# Altium schematic sheet ch32-mainboard-v4.SchDoc
size A2
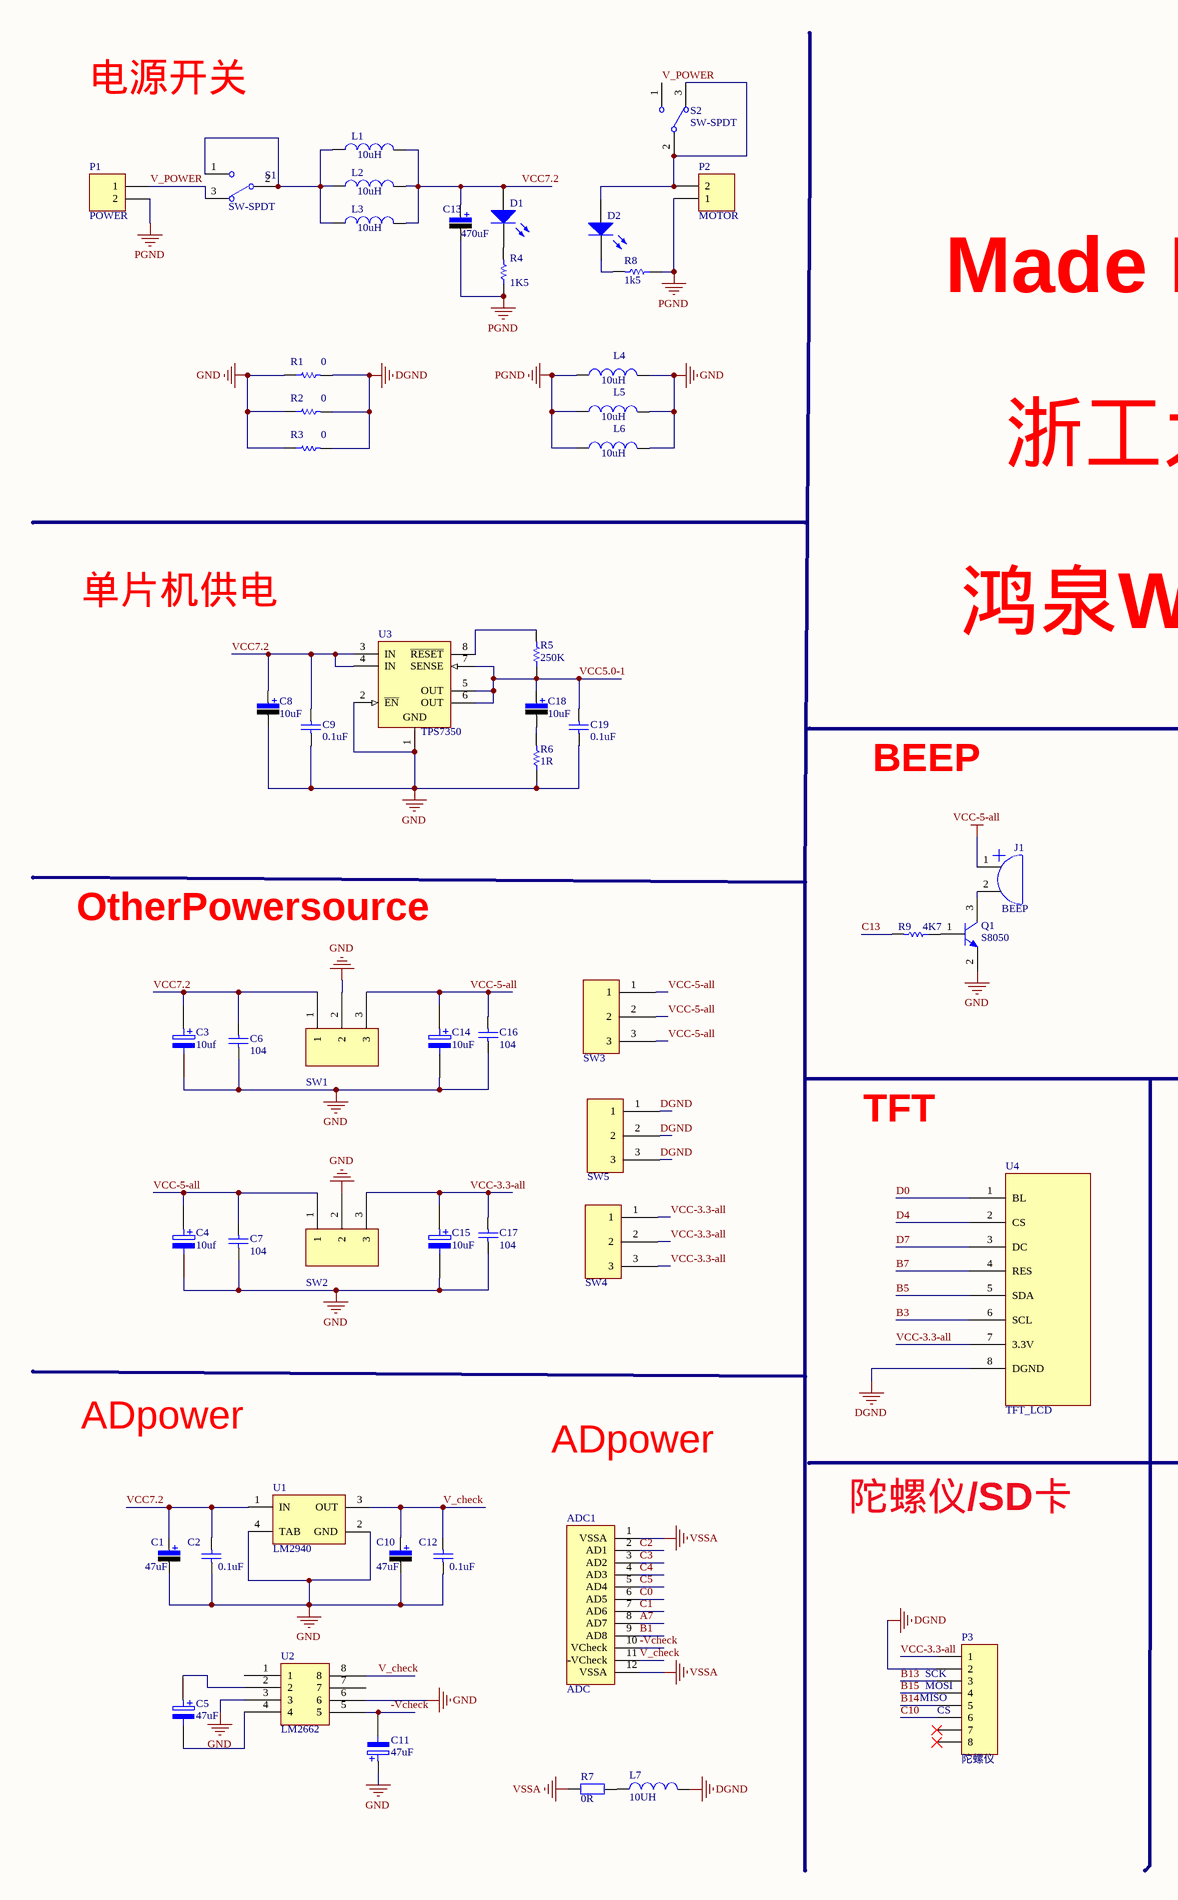
[diagram p0: ch32-mainboard-v4.SchDoc, left]
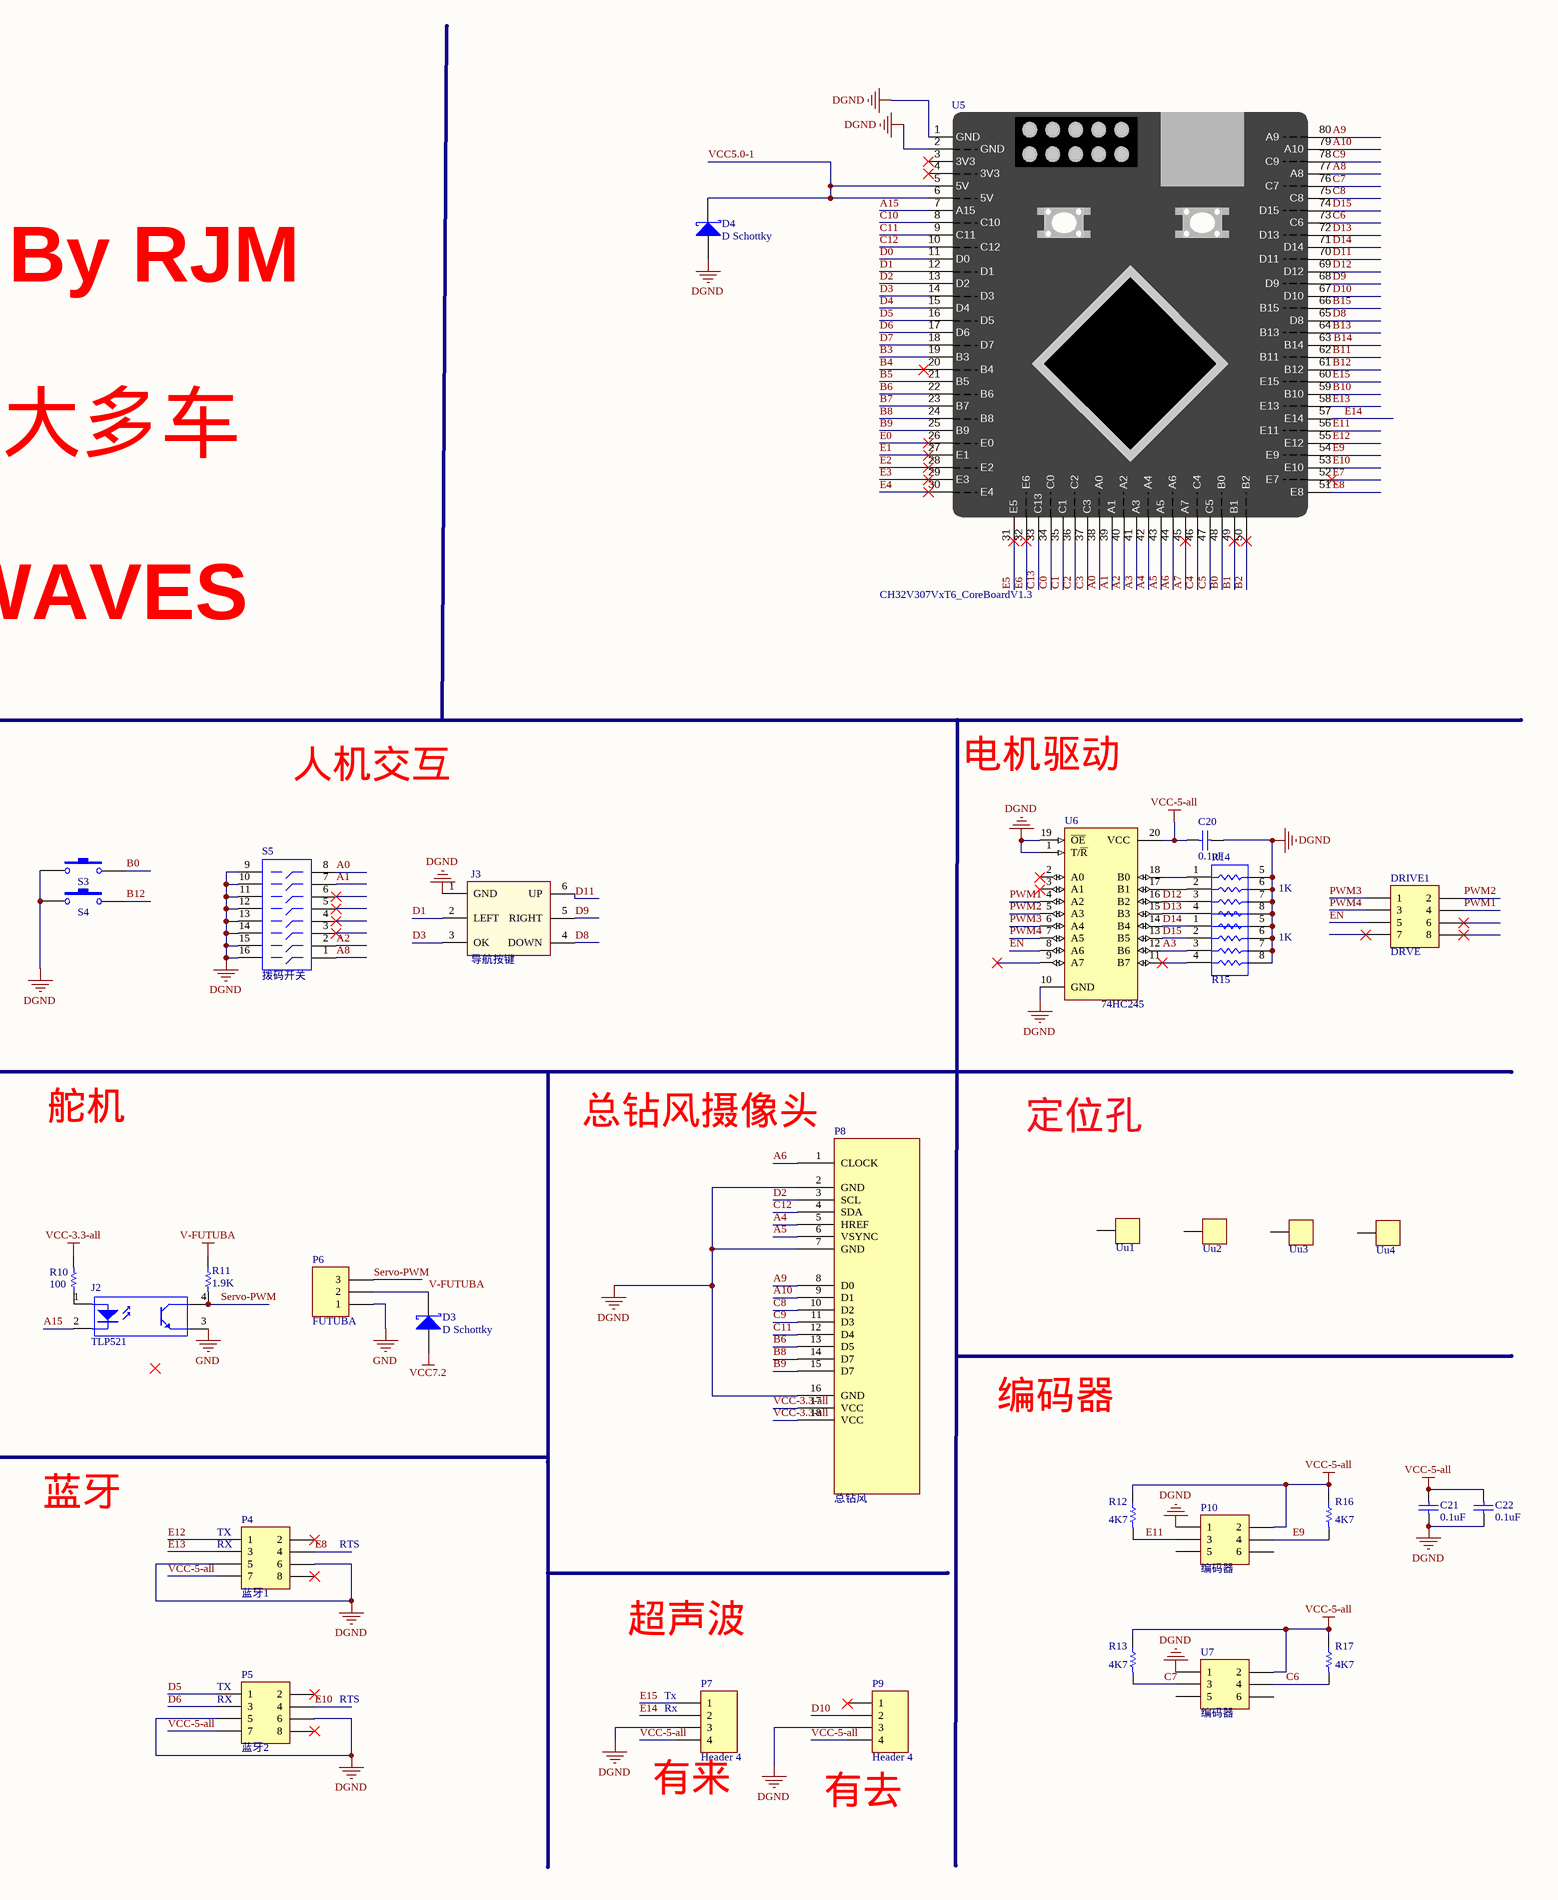
[diagram p1: ch32-mainboard-v4.SchDoc, right]

## Parts
ADC1  ADC  [FPC0.5 2H-WS-12P]
C1  value 47uF  [LC-CASE-B_3528]  (hidden comment: Cap-Pol)
C2  value 0.1uF  [LC-0805_C]  (hidden comment: Cap)
C3  10uf  [LC-CASE-B_3528]
C4  10uf  [LC-CASE-B_3528]
C5  47uF  [LC-CASE-B_3528]
C6  104  [LC-0805_C]
C7  104  [LC-0805_C]
C8  value 10uF  [LC-CASE-B_3528]  (hidden comment: Cap-Pol)
C9  value 0.1uF  [LC-0805_C]  (hidden comment: Cap)
C10  value 47uF  [LC-CASE-B_3528]  (hidden comment: Cap-Pol)
C11  47uF  [LC-CASE-B_3528]
C12  value 0.1uF  [LC-0805_C]  (hidden comment: Cap)
C13  value 470uF  [C-RB-SD10]  (hidden comment: Cap-Pol-ES)
C14  10uF  [LC-CASE-B_3528]
C15  10uF  [LC-CASE-B_3528]
C16  104  [LC-0805_C]
C17  104  [LC-0805_C]
C18  value 10uF  [LC-CASE-A_3216]  (hidden comment: Cap-Pol)
C19  value 0.1uF  [LC-0805_C]  (hidden comment: Cap)
C20  value 0.1uF  [LC-0805_C]  (hidden comment: Cap)
C21  value 0.1uF  [LC-0805_R]  (hidden comment: Cap)
C22  value 0.1uF  [LC-0805_R]  (hidden comment: Cap)
D1  LED  [LED0805]  (value not drawn)
D2  LED  [LED0805]  (value not drawn)
D3  D Schottky  [LC-SMB(DO-214AA)_S1]
D4  D Schottky  [LC-SMB(DO-214AA)_S1]
DRIVE1  DRVE  [MHDR2X4]
J1  BEEP  [FMQ-mini]
J2  TLP521  [LC-SOP-4_P2.54]
J3  导航按键  [KEY_5]
L1  value 10uH  [LC-0805_L]  (hidden comment: Inductor)
L2  value 10uH  [LC-0805_L]  (hidden comment: Inductor)
L3  value 10uH  [LC-0805_L]  (hidden comment: Inductor)
L4  value 10uH  [LC-0805_L]  (hidden comment: Inductor)
L5  value 10uH  [LC-0805_L]  (hidden comment: Inductor)
L6  value 10uH  [LC-0805_L]  (hidden comment: Inductor)
L7  10UH  [LC-0805_L]
P1  POWER  [Con 2接线端子]
P2  MOTOR  [Con 2接线端子]
P3  陀螺仪  [HDR1X8]
P4  蓝牙1  [HDR2X4]
P5  蓝牙2  [HDR2X4]
P6  FUTUBA  [HDR3X1-2.54]
P7  Header 4  [HDR1X4]
P8  总钻风  [总钻风直插]
P9  Header 4  [HDR1X4]
P10  编码器  [编码器]
Q1  S8050  [SOT23-3]
R1  value 0  [LC-0805_R]  (hidden comment: Res1)
R2  value 0  [LC-0805_R]  (hidden comment: Res1)
R3  value 0  [LC-0805_R]  (hidden comment: Res1)
R4  value 1K5  [LC-0805_R]  (hidden comment: Res1)
R5  value 250K  [LC-0805_R]  (hidden comment: Res1)
R6  value 1R  [LC-0805_R]  (hidden comment: Res1)
R7  value 0R  [LC-0805_L]  (hidden comment: 0k)
R8  value 1k5  [LC-0805_R]  (hidden comment: Res1)
R9  value 4K7  [LC-0805_R]  (hidden comment: Res1)
R10  value 100  [LC-0805_R]  (hidden comment: Res1)
R11  value 1.9K  [LC-0805_R]  (hidden comment: Res1)
R12  value 4K7  [LC-0805_R]  (hidden comment: Res1)
R13  value 4K7  [LC-0805_R]  (hidden comment: 4.7k)
R14  value 1K  [LC-0603_Rx4]  (hidden comment: Res Pack)
R15  value 1K  [LC-0603_Rx4]  (hidden comment: Res Pack)
R16  value 4K7  [LC-0805_R]  (hidden comment: Res1)
R17  value 4K7  [LC-0805_R]  (hidden comment: 4.7k)
S1  SW-SPDT  [纽子开关]
S2  SW-SPDT  [纽子开关]
S3  SW-PB  [SW_PB2_A1]  (value not drawn)
S4  SW-PB  [SW_PB2_A1]  (value not drawn)
S5  拨码开关  [DIP-16-KEY]
SW1  Switch  [LC-TO-263-3]  (value not drawn)
SW2  Switch  [LC-TO-263-3]  (value not drawn)
SW3  Switch  [HDR3X1_2.54_3pin]  (value not drawn)
SW4  Switch  [HDR3X1_2.54_3pin]  (value not drawn)
SW5  Switch  [HDR3X1_2.54_3pin]  (value not drawn)
U1  LM2940  [LC-SOT-223]
U2  LM2662  [LC-SOIC-8_150mil]
U3  TPS7350  [LC-SOIC-8_150mil]
U4  TFT_LCD  [HDR1X4_100_8pin]
U5  CH32V307VxT6_CoreBoardV1.3  [CH32V307VxT6_CoreBoard]
U6  74HC245  [TSSOP20]
U7  编码器  [编码器]
Uu1  定位孔  [定位孔]  (value not drawn)
Uu2  定位孔  [定位孔]  (value not drawn)
Uu3  定位孔  [定位孔]  (value not drawn)
Uu4  定位孔  [定位孔]  (value not drawn)

## Nets
DGND: C20.1 C21.1 C22.1 D4.1(A) J3.1(GND) L7.2 P3.2 P4.5 P4.6 P5.5 P5.6 P7.3 P8.2(GND) P8.7(GND) P8.16(GND) P9.3 P10.1 R1.2 R2.2 R3.2 R14.5 R14.6 R14.7 R14.8 R15.5 R15.6 R15.7 R15.8 S3.1 S4.1 S5.9 S5.10 S5.11 S5.12 S5.13 S5.14 S5.15 S5.16 SW5.1 SW5.2 SW5.3 U4.8(DGND) U5.1(GND) U5.2(GND) U6.1(T/~{R}) U6.10(GND) U6.19(~{OE}) U7.1
GND: C1.2 C2.1 C3.2 C4.2 C6.1 C7.1 C8.2 C9.1 C10.2 C11.1 C12.1 C14.2 C15.2 C16.1 C17.1 C19.1 J2.3(E) L4.2 L5.2 L6.2 P6.1 Q1.2(E) R1.1 R2.1 R3.1 R6.1 SW1.2 SW2.2 U1.2(GND) U1.4(TAB) U2.3 U2.6 U3.1(GND) U3.2(~{EN})
PGND: C13.2 L4.1 L5.1 L6.1 P1.2 P2.1 R4.1 R8.1
V-FUTUBA: D3.2(K) P6.2 R11.1
VCC7.2: C1.1 C2.2 C3.1 C6.2 C8.1 C9.2 C13.1 D1.1(A) D3.1(A) L1.2 L2.2 L3.2 SW1.1 U1.1(IN) U3.3(IN) U3.4(IN)
VCC-3.3-all: C15.1 C17.2 P3.1 P8.17(VCC) P8.18(VCC) R10.2 SW2.3 SW4.1 SW4.2 SW4.3 U4.7(3.3V)
VCC-5-all: C4.1 C7.2 C14.1 C16.2 C20.2 C21.2 C22.2 J1.1 P4.7 P5.7 P7.4 P9.4 P10.2 R12.1 R13.1 R16.1 R17.1 SW1.3 SW2.1 SW3.1 SW3.2 SW3.3 U6.20(VCC) U7.2
VSSA: ADC1.1(VSSA) ADC1.12(VSSA) R7.1
-Vcheck: ADC1.10(VCheck) C11.2 U2.5
A0: S5.8 U5.38(A0)
A1: S5.7 U5.39(A1)
A2: S5.2 U5.40(A2)
A3: R15.3 U5.41(A3) U6.12(B6)
A4: P8.5(HREF) U5.42(A4)
A5: P8.6(VSYNC) U5.43(A5)
A6: P8.1(CLOCK) U5.44(A6)
A7: ADC1.8(AD7) U5.45(A7)
A8: S5.1 U5.77(A8)
A9: P8.8(D0) U5.80(A9)
A10: P8.9(D1) U5.79(A10)
A15: J2.2(K) U5.7(A15)
B0: S3.2 U5.48(B0)
B1: ADC1.9(AD8) U5.49(B1)
B2: U5.50(B2)
B3: U4.6(SCL) U5.19(B3)
B4: U5.20(B4)
B5: U4.5(SDA) U5.21(B5)
B6: P8.13(D5) U5.22(B6)
B7: U4.4(RES) U5.23(B7)
B8: P8.14(D7) U5.24(B8)
B9: P8.15(D7) U5.25(B9)
B10: U5.59(B10)
B11: U5.62(B11)
B12: S4.2 U5.61(B12)
B13: P3.3 U5.64(B13)
B14: P3.5 U5.63(B14)
B15: P3.4 U5.66(B15)
C0: ADC1.6(AD5) U5.34(C0)
C1: ADC1.7(AD6) U5.35(C1)
C2: ADC1.2(AD1) U5.36(C2)
C3: ADC1.3(AD2) U5.37(C3)
C4: ADC1.4(AD3) U5.46(C4)
C5: ADC1.5(AD4) U5.47(C5)
C6: R17.2 U5.73(C6) U7.4
C7: R13.2 U5.76(C7) U7.3
C8: P8.10(D2) U5.75(C8)
C9: P8.11(D3) U5.78(C9)
C10: P3.6 U5.8(C10)
C11: P8.12(D4) U5.9(C11)
C12: P8.4(SDA) U5.10(C12)
C13: R9.2 U5.33(C13)
D0: U4.1(BL) U5.11(D0)
D1: J3.2(LEFT) U5.12(D1)
D2: P8.3(SCL) U5.13(D2)
D3: J3.3(OK) U5.14(D3)
D4: U4.2(CS) U5.15(D4)
D5: P5.1 U5.16(D5)
D6: P5.3 U5.17(D6)
D7: U4.3(DC) U5.18(D7)
D8: J3.4(DOWN) U5.65(D8)
D9: J3.5(RIGHT) U5.68(D9)
D10: P9.2 U5.67(D10)
D11: J3.6(UP) U5.70(D11)
D12: R14.3 U5.69(D12) U6.16(B2)
D13: R14.4 U5.72(D13) U6.15(B3)
D14: R15.1 U5.71(D14) U6.14(B4)
D15: R15.2 U5.74(D15) U6.13(B5)
E0: U5.26(E0)
E1: U5.27(E1)
E2: U5.28(E2)
E3: U5.29(E3)
E4: U5.30(E4)
E5: U5.31(E5)
E6: U5.32(E6)
E7: U5.52(E7)
E8: P4.4 U5.51(E8)
E9: P10.4 R16.2 U5.54(E9)
E10: P5.4 U5.53(E10)
E11: P10.3 R12.2 U5.56(E11)
E12: P4.1 U5.55(E12)
E13: P4.3 U5.58(E13)
E14: P7.2 U5.57(E14)
E15: P7.1 U5.60(E15)
EN: DRIVE1.5 U6.8(A6)
PWM1: DRIVE1.4 U6.4(A2)
PWM2: DRIVE1.2 U6.5(A3)
PWM3: DRIVE1.1 U6.6(A4)
PWM4: DRIVE1.3 U6.7(A5)
Servo-PWM: J2.4(C) P6.3 R11.2
V_check: ADC1.11(-VCheck) C10.1 C12.2 U1.3(OUT) U2.8
V_POWER: P1.1 S1.3 S2.1
VCC5.0-1: C18.1 C19.2 D4.2(K) R5.1 U3.5(OUT) U3.6(OUT) U3.7(SENSE) U5.5(5V) U5.6(5V)
NetC5_1: C5.1 U2.2
NetC5_2: C5.2 U2.4
NetC18_2: C18.2 R6.2
NetD1_2: D1.2(K) R4.2
NetD2_1: D2.1(A) P2.2 S2.2 S2.3
NetD2_2: D2.2(K) R8.2
NetJ1_2: J1.2 Q1.3(C)
NetJ2_1: J2.1(A) R10.1
NetL1_1: L1.1 L2.1 L3.1 S1.1 S1.2
NetL7_1: L7.1 R7.2
NetQ1_1: Q1.1(B) R9.1
NetR5_2: R5.2 U3.8(~{RESET})
NetR14_1: R14.1 U6.18(B0)
NetR14_2: R14.2 U6.17(B1)
NetR15_4: R15.4 U6.11(B7)

Not connected (* = marked no-connect by the designer): DRIVE1 6* 7* 8*; P3 7* 8*; P4 2* 8*; P5 2* 8*; P9 1*; P10 5 6; S5 3* 4* 5* 6*; U2 1 7; U5 3(3V3)* 4(3V3)*; U6 2(A0)* 3(A1)* 9(A7)*; U7 5 6; Uu1 1; Uu2 1; Uu3 1; Uu4 1

## Notes on the sheet
- 电源开关
- Made By RJM
- 浙工大多车
- 单片机供电
- 鸿泉WAVES
- BEEP
- 人机交互
- 电机驱动
- OtherPowersource
- TFT
- 舵机
- 总钻风摄像头
- 定位孔
- ADpower
- 编码器
- 陀螺仪/SD卡
- 蓝牙
- (near P4) TX
- (near P4) RX
- RTS
- (near P3) SCK
- (near P3) MOSI
- 超声波
- (near P3) CS
- (near P3) MISO
- (near P5) TX
- (near P5) RX
- (near P7) Tx
- (near P7) Rx
- (near P7) 有来
- (near P9) 有去

## Library data of the parts
C1 C8 C10 C18 = Cap-Pol-A: 钽电容; Published: 8-Jun-2000; LatestRevisionDate: 17-Jul-2002; LatestRevisionNote: Re-released for DXP Platform.; PackageReference: RB7.6-15; Publisher: Altium Limited
C2 C9 C12 C19-C22 = Cap: Capacitor; Published: 8-Jun-2000; LatestRevisionDate: 17-Jul-2002; LatestRevisionNote: Re-released for DXP Platform.; PackageReference: RAD-0.3; Publisher: Altium Limited; PackageDescription: Radial Cap, Thru-Hole; 2 Leads; 0.3 in Pin Spacing
C3 C4 C14 C15 = ELECTRO2: Electrolytic Capacitor
C5 C11 = ELECTRO2_1: Electrolytic Capacitor; Value: 47uF
C6 C7 C16 C17 = CAP-0603
C13 = Cap-Pol-ES: 固态电容; Published: 8-Jun-2000; LatestRevisionDate: 17-Jul-2002; LatestRevisionNote: Re-released for DXP Platform.; PackageReference: RB7.6-15; Publisher: Altium Limited
D1 D2 = LED0: Typical INFRARED GaAs LED; Published: 8-Jun-2000; LatestRevisionDate: 08-Jul-2005; LatestRevisionNote: Mech Layer 1 removed.; PackageReference: LED-0; Publisher: Altium Limited; PackageDescription: LED; 2 Leads
D3 D4 = D Schottky: Schottky Diode; Published: 8-Jun-2000; LatestRevisionDate: 17-Jul-2002; LatestRevisionNote: Re-released for DXP Platform.; PackageReference: SMB; Publisher: Altium Limited; PackageDescription: DO-214-AA/SMB; 2 C-Bend Leads; Body 5.3 x 3.6 mm, inc. leads (LxW); Code_JEDEC: DO-214-AA
DRIVE1 P4 P5 = Header 4X2: 电机驱动接口; LatestRevisionDate: 17-Jul-2002; LatestRevisionNote: Re-released for DXP Platform.; Publisher: Altium Limited
J1 = BEEP-S: 有源蜂鸣器0905
J2 = TLP281: 光耦; Published: 24-Mar-1999; LatestRevisionDate: 04-Mar-2005; LatestRevisionNote: Sch pins 3 & 4 Swapped.; DatasheetDocument: Nov-2003; PackageReference: DIP-4; Publisher: Altium Limited
J3 = KEY_5: 五向导航按键
L1-L6 = Inductor: Code_IEC: 1005; Published: 8-Jun-2000; LatestRevisionDate: 29-May-2009; LatestRevisionNote: IPC-7351 Footprint Added.; PackageReference: 0402-A; Publisher: Altium Limited; PackageDescription: Chip Inductor; Code_JEITA: 0402
L7 = 0805 电感_L
P1 P2 = Header 2: Header, 2-Pin; LatestRevisionDate: 17-Jul-2002; LatestRevisionNote: Re-released for DXP Platform.; Publisher: Altium Limited
P3 = Header 8: Header, 8-Pin; LatestRevisionDate: 17-Jul-2002; LatestRevisionNote: Re-released for DXP Platform.; Publisher: Altium Limited
P6 = Header 3: Header, 3-Pin; LatestRevisionDate: 17-Jul-2002; LatestRevisionNote: Re-released for DXP Platform.; Publisher: Altium Limited
P7 P9 = Header 4: Header, 4-Pin; LatestRevisionDate: 17-Jul-2002; LatestRevisionNote: Re-released for DXP Platform.; Publisher: Altium Limited
P10 U7 = Header 3X2: 光电编码器接口; LatestRevisionDate: 17-Jul-2002; LatestRevisionNote: Re-released for DXP Platform.; Publisher: Altium Limited
Q1 = SS9014: NPN贴片三极管; Published: 8-Jun-2000; LatestRevisionDate: 15-Jan-2003; LatestRevisionNote: PCB Footprint 'BCY-W3/D4.7' replaced; DatasheetDocument: 1997; PackageDocument: Sep-1998; PackageReference: TO-92A; Publisher: Altium Limited; Code_JEDEC: TO-92A; ComponentLink1Description: Manufacturer Link; ComponentLink1URL: http://www.fairchildsemi.com/; ComponentLink2Description: Datasheet; ComponentLink2URL: http://www.fairchildsemi.com/ds/2N%2F2N3904.pdf
R1-R6 R8-R13 R16 R17 = Res1: Resistor; Published: 8-Jun-2000; LatestRevisionDate: 17-Jul-2002; LatestRevisionNote: Re-released for DXP Platform.; PackageReference: AXIAL-0.3; Publisher: Altium Limited; PackageDescription: Axial Device, Thru-Hole; 2 Leads; 0.3 in Pin Spacing
R7 = Res_L: Resistor; Published: 8-Jun-2000; LatestRevisionDate: 17-Jul-2002; LatestRevisionNote: Re-released for DXP Platform.; PackageReference: AXIAL-0.4; Publisher: Altium Limited
R14 R15 = Res Pack: Isolated Resistor Network; Published: 24-Mar-1999; LatestRevisionDate: 29-May-2009; LatestRevisionNote: IPC-7351 Footprint Added.; PackageReference: SO-16; Publisher: Altium Limited; PackageDescription: 16-Pin Small Outline Integrated Circuit 1.27 mm Pitch; Code_JEDEC: MS-012-AC; Code_IPC: SOIC127P600-16
S1 S2 = SW-SPDT: SPDT Subminiature Toggle Switch, Right Angle Mounting, Vertical Actuation; Published: 24-Mar-1999; LatestRevisionDate: 17-Dec-2003; LatestRevisionNote: Schematic revised, PCB Footprint replaced.; DatasheetVersion: 05-Dec-2000; PackageReference: TL36WW15050; Publisher: Altium Limited; PackageDescription: Switch; 4 Leads; ComponentLink1Description: Manufacturer Link; ComponentLink1URL: http://www.apem.com
S3 S4 = SW-PB: 两脚贴片微动开关; Published: 24-Mar-1999; LatestRevisionDate: 17-Jul-2002; LatestRevisionNote: Re-released for DXP Platform.; PackageReference: SPST-2; Publisher: Altium Limited
S5 = SW-DIP8: 八位拨码开关; Published: 24-Mar-1999; LatestRevisionDate: 17-Dec-2003; LatestRevisionNote: PCB Footprint replaced.; PackageReference: DIP-16-KEY; Publisher: Altium Limited; PackageDescription: DIP; 16 Leads; Row Spacing 7.62 mm; Pitch 2.54 mm; ComponentLink1Description: Manufacturer Link; ComponentLink1URL: http://www.oupiin.com/prodindx.html#Headers
SW1-SW5 = 3
U1 = LM2940IMP-5.0: 1A Low Dropout Regulator; Manufacturer: National Semiconductor; CompType: LDO IC; PackageTopMarking: XYTT*L53B; PowerWise: N; Published: 4-Dec-2008; DatasheetVersion: Jan-2007; PackageVersion: revB, Apr-2003; PackageReference: MP04A; Publisher: Altium Limited; PackageDescription: Molded SOT-223, 6.50 x 3.56 x 1.6mm Body, 4 Lead, 2.3mm Pitch; PartNumber: LM2940IMP-5.0; RoHS: O; PinCount: 4; DigiKeyPartNumber: LM2940IMP-5.0TR-ND; Code_JEDEC: TO-261-AA; Code_IPC: SOT223-4; ComponentLink1Description: LM2940 Datasheet; ComponentLink1URL: http://www.national.com/ds/LM/LM2940.pdf; ComponentLink2Description: LM2940 Web Page; ComponentLink2URL: http://www.national.com/pf/LM/LM2940.html; ComponentLink3Description: MP04A Package Page; ComponentLink3URL: http://www.national.com/packaging/folders/mp04a.html
U3 = TPS7350QD: Single Output LDO, 500 mA, Fixed 5 V Output, 5.33 to 10 V Input, with Integrated SVS, 8-pin SOIC (D), -40 to 125 degC, Green (RoHS & no Sb/Br); Manufacturer: Texas Instruments; Fixed Output Options(V): 5; Iout(Max)(A): 0.5; Iq(Typ)(mA): 0.3; SubFamily: Single Channel LDO; Vdo(Typ)(mV): 270; Vin(Max)(V): 10; Vin(Min)(V): 5.33; DatasheetVersion: SLVS124F; PackageVersion: 4040047-3/M; PackageReference: D8; PackageDescription: 8-Pin Plastic Small Outline, Body 4.9 x 3.9 mm, Pitch 1.27 mm; Supplier 1: Digi-Key; Supplier Part Number 1: 296-8069-5-ND; Supplier 2: Farnell; Supplier Part Number 2: 8461147; Supplier 3: Newark; Supplier Part Number 3: 38K8800; Supplier 4: Newark; Supplier Part Number 4: 52F2805; Supplier 5: Mouser; Supplier Part Number 5: 595-TPS7350QD; Eco-Plan: Green (RoHS & no Sb/Br); Vout Adj(Max)(V): 5; Vout Adj(Min)(V): 5; Mounting Technology: Surface Mount; Code_JEDEC: MS-012; PartNumber: TPS7350QD; ComponentLink1Description: Manufacturer URL; ComponentLink1URL: http://www.ti.com/; ComponentLink2Description: Datasheet; ComponentLink2URL: http://www.ti.com/general/docs/lit/getliterature.tsp?genericPartNumber=TPS7350&fileType=pdf; ComponentLink3Description: Package Specification; ComponentLink3URL: http://www.ti.com/litv/pdf/msoi002j
U6 = SN74LVC245DW: Octal Bus Transceiver with 3-State Outputs; ComponentAvailability: Obsolete; Published: 8-Jun-2000; LatestRevisionDate: 13-Apr-2006; LatestRevisionNote: IPC-7351 Footprint Added.; DatasheetVersion: Jul-1994; PackageVersion: Mar-2000; PackageReference: DW020; Publisher: Altium Limited; PackageDescription: 20-Pin Plastic Small Outline Integrated Circuit 1.27 mm Pitch; Code_JEDEC: MS-013; Code_IPC: SOIC127P1030-20; ComponentLink1Description: Manufacturer Link; ComponentLink1URL: http://www.ti.com/; ComponentLink2Description: URL Link1; ComponentLink2URL: http://focus.ti.com/docs/prod/folders/print/sn74lvc245.html